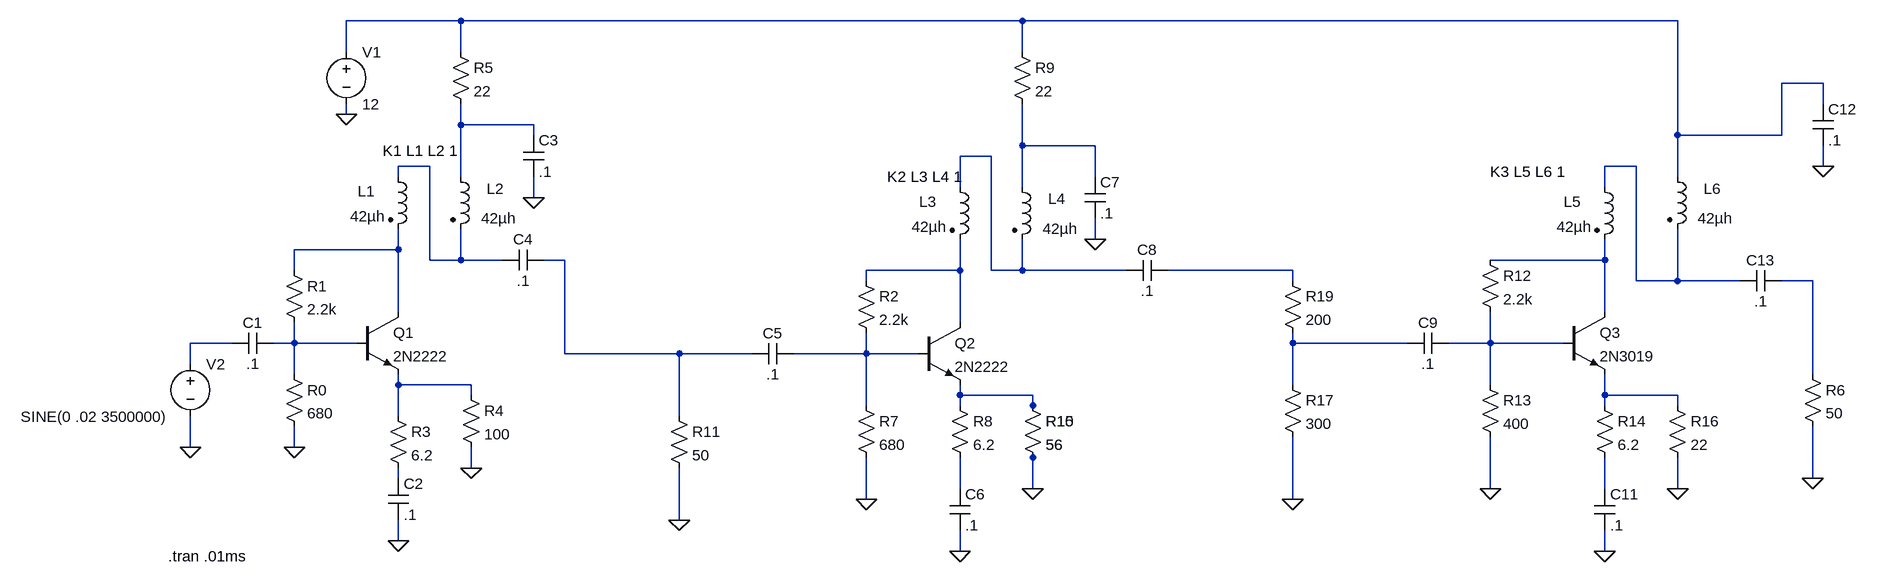
[diagram p0: schematic farhan3.asc]
farhan3.asc, the LTspice schematic file:
Version 4
SHEET 1 2164 768
WIRE -576 256 -576 224
WIRE -576 384 -576 336
WIRE -512 224 -576 224
WIRE -416 112 -416 80
WIRE -416 224 -448 224
WIRE -416 224 -416 192
WIRE -416 272 -416 224
WIRE -416 384 -416 352
WIRE -336 -224 -336 -272
WIRE -336 -128 -336 -144
WIRE -320 224 -416 224
WIRE -256 -32 -256 -48
WIRE -256 80 -416 80
WIRE -256 80 -256 48
WIRE -256 176 -256 80
WIRE -256 288 -256 272
WIRE -256 336 -256 288
WIRE -256 432 -256 416
WIRE -256 528 -256 496
WIRE -208 -48 -256 -48
WIRE -208 96 -208 -48
WIRE -160 -272 -336 -272
WIRE -160 -224 -160 -272
WIRE -160 -112 -160 -144
WIRE -160 -32 -160 -112
WIRE -160 96 -208 96
WIRE -160 96 -160 48
WIRE -144 288 -256 288
WIRE -144 304 -144 288
WIRE -144 416 -144 384
WIRE -96 96 -160 96
WIRE -48 -112 -160 -112
WIRE -48 -96 -48 -112
WIRE -48 0 -48 -32
WIRE 0 96 -32 96
WIRE 0 240 0 96
WIRE 176 240 0 240
WIRE 176 336 176 240
WIRE 176 496 176 416
WIRE 288 240 176 240
WIRE 464 128 464 112
WIRE 464 240 352 240
WIRE 464 240 464 208
WIRE 464 320 464 240
WIRE 464 464 464 400
WIRE 544 240 464 240
WIRE 608 -16 608 -64
WIRE 608 112 464 112
WIRE 608 112 608 64
WIRE 608 192 608 112
WIRE 608 304 608 288
WIRE 608 320 608 304
WIRE 608 448 608 400
WIRE 608 544 608 512
WIRE 656 -64 608 -64
WIRE 656 112 656 -64
WIRE 704 -272 -160 -272
WIRE 704 -224 704 -272
WIRE 704 -80 704 -144
WIRE 704 -16 704 -80
WIRE 704 112 656 112
WIRE 704 112 704 64
WIRE 720 304 608 304
WIRE 720 320 720 304
WIRE 720 448 720 400
WIRE 816 -80 704 -80
WIRE 816 -32 816 -80
WIRE 816 64 816 32
WIRE 864 112 704 112
WIRE 1120 112 928 112
WIRE 1120 128 1120 112
WIRE 1120 224 1120 208
WIRE 1120 288 1120 224
WIRE 1120 464 1120 368
WIRE 1296 224 1120 224
WIRE 1424 224 1360 224
WIRE 1424 224 1424 176
WIRE 1424 288 1424 224
WIRE 1424 448 1424 368
WIRE 1536 224 1424 224
WIRE 1600 -16 1600 -48
WIRE 1600 96 1424 96
WIRE 1600 96 1600 64
WIRE 1600 176 1600 96
WIRE 1600 304 1600 272
WIRE 1600 320 1600 304
WIRE 1600 448 1600 400
WIRE 1600 544 1600 512
WIRE 1648 -48 1600 -48
WIRE 1648 128 1648 -48
WIRE 1712 -272 704 -272
WIRE 1712 -96 1712 -272
WIRE 1712 -32 1712 -96
WIRE 1712 128 1648 128
WIRE 1712 128 1712 48
WIRE 1712 304 1600 304
WIRE 1712 320 1712 304
WIRE 1712 448 1712 400
WIRE 1808 128 1712 128
WIRE 1872 -96 1712 -96
WIRE 1872 -96 1872 -176
WIRE 1920 128 1872 128
WIRE 1920 272 1920 128
WIRE 1920 432 1920 352
WIRE 1936 -176 1872 -176
WIRE 1936 -144 1936 -176
WIRE 1936 -48 1936 -80
FLAG -416 384 0
FLAG -144 416 0
FLAG -256 528 0
FLAG -48 0 0
FLAG 1920 432 0
FLAG -336 -128 0
FLAG -576 384 0
FLAG 608 544 0
FLAG 464 464 0
FLAG 816 64 0
FLAG 720 448 0
FLAG 176 496 0
FLAG 1424 448 0
FLAG 1936 -48 0
FLAG 1712 448 0
FLAG 1120 464 0
FLAG 1600 544 0
SYMBOL cap -448 208 R90
WINDOW 0 0 32 VBottom 0
WINDOW 3 32 32 VTop 0
SYMATTR InstName C1
SYMATTR Value .1
SYMBOL res -432 96 R0
SYMATTR InstName R1
SYMATTR Value 2.2k
SYMBOL res -432 256 R0
SYMATTR InstName R0
SYMATTR Value 680
SYMBOL npn -320 176 R0
SYMATTR InstName Q1
SYMATTR Value 2N2222
SYMBOL res -272 320 R0
SYMATTR InstName R3
SYMATTR Value 6.2
SYMBOL res -160 288 R0
SYMATTR InstName R4
SYMATTR Value 100
SYMBOL cap -272 432 R0
SYMATTR InstName C2
SYMATTR Value .1
SYMBOL res -176 -240 R0
SYMATTR InstName R5
SYMATTR Value 22
SYMBOL cap -64 -96 R0
SYMATTR InstName C3
SYMATTR Value .1
SYMBOL ind2 -272 -48 R0
WINDOW 0 -47 38 Left 0
WINDOW 3 -58 77 Left 0
SYMATTR InstName L1
SYMATTR Value 42µh
SYMATTR Type ind
SYMBOL ind2 -176 -48 R0
WINDOW 0 56 34 Left 0
WINDOW 3 47 80 Left 0
SYMATTR InstName L2
SYMATTR Value 42µh
SYMATTR Type ind
SYMBOL cap -32 80 R90
WINDOW 0 0 32 VBottom 0
WINDOW 3 32 32 VTop 0
SYMATTR InstName C4
SYMATTR Value .1
SYMBOL res 1904 256 R0
SYMATTR InstName R6
SYMATTR Value 50
SYMBOL voltage -336 -240 R0
WINDOW 123 0 0 Left 0
WINDOW 39 0 0 Left 0
SYMATTR InstName V1
SYMATTR Value 12
SYMBOL voltage -576 240 R0
WINDOW 3 -261 97 Left 0
WINDOW 123 0 0 Left 0
WINDOW 39 -259 132 Left 0
SYMATTR InstName V2
SYMATTR Value SINE(0 .02 3500000)
SYMBOL npn 544 192 R0
SYMATTR InstName Q2
SYMATTR Value 2N2222
SYMBOL cap 352 224 R90
WINDOW 0 0 32 VBottom 0
WINDOW 3 32 32 VTop 0
SYMATTR InstName C5
SYMATTR Value .1
SYMBOL res 448 112 R0
SYMATTR InstName R2
SYMATTR Value 2.2k
SYMBOL res 448 304 R0
SYMATTR InstName R7
SYMATTR Value 680
SYMBOL res 592 304 R0
SYMATTR InstName R8
SYMATTR Value 6.2
SYMBOL cap 592 448 R0
SYMATTR InstName C6
SYMATTR Value .1
SYMBOL ind2 592 -32 R0
WINDOW 0 -47 38 Left 0
WINDOW 3 -58 77 Left 0
SYMATTR InstName L3
SYMATTR Value 42µh
SYMATTR Type ind
SYMBOL ind2 688 -32 R0
WINDOW 0 56 34 Left 0
WINDOW 3 47 80 Left 0
SYMATTR InstName L4
SYMATTR Value 42µh
SYMATTR Type ind
SYMBOL res 688 -240 R0
SYMATTR InstName R9
SYMATTR Value 22
SYMBOL cap 800 -32 R0
SYMATTR InstName C7
SYMATTR Value .1
SYMBOL cap 928 96 R90
WINDOW 0 0 32 VBottom 0
WINDOW 3 32 32 VTop 0
SYMATTR InstName C8
SYMATTR Value .1
SYMBOL res 704 304 R0
SYMATTR InstName R10
SYMATTR Value 56
SYMBOL res 160 320 R0
SYMATTR InstName R11
SYMATTR Value 50
SYMBOL cap 1360 208 R90
WINDOW 0 0 32 VBottom 0
WINDOW 3 32 32 VTop 0
SYMATTR InstName C9
SYMATTR Value .1
SYMBOL res 1408 80 R0
SYMATTR InstName R12
SYMATTR Value 2.2k
SYMBOL res 1408 272 R0
SYMATTR InstName R13
SYMATTR Value 400
SYMBOL npn 1536 176 R0
SYMATTR InstName Q3
SYMATTR Value 2N3019
SYMBOL res 1584 304 R0
SYMATTR InstName R14
SYMATTR Value 6.2
SYMBOL res 704 304 R0
SYMATTR InstName R15
SYMATTR Value 56
SYMBOL res 1696 304 R0
SYMATTR InstName R16
SYMATTR Value 22
SYMBOL cap 1584 448 R0
SYMATTR InstName C11
SYMATTR Value .1
SYMBOL ind2 1584 -32 R0
WINDOW 0 -47 38 Left 0
WINDOW 3 -58 77 Left 0
SYMATTR InstName L5
SYMATTR Value 42µh
SYMATTR Type ind
SYMBOL ind2 1696 -48 R0
WINDOW 0 56 34 Left 0
WINDOW 3 47 80 Left 0
SYMATTR InstName L6
SYMATTR Value 42µh
SYMATTR Type ind
SYMBOL cap 1920 -144 R0
SYMATTR InstName C12
SYMATTR Value .1
SYMBOL res 1104 272 R0
SYMATTR InstName R17
SYMATTR Value 300
SYMBOL cap 1872 112 R90
WINDOW 0 0 32 VBottom 0
WINDOW 3 32 32 VTop 0
SYMATTR InstName C13
SYMATTR Value .1
SYMBOL res 1104 112 R0
SYMATTR InstName R19
SYMATTR Value 200
TEXT -280 -72 Left 0 !K1 L1 L2 1
TEXT -610 552 Left 0 !.tran .01ms
TEXT 496 -32 Left 0 !K2 L3 L4 1
TEXT 1424 -40 Left 0 !K3 L5 L6 1

The netlist it stands for:
* farhan3.asc
C1 N003 N001 .1
R1 N002 N003 2.2k
R0 N003 0 680
Q1 N002 N003 N006 0 2N2222
R3 N006 N007 6.2
R4 N006 0 100
C2 N007 0 .1
R5 N004 N008 22
C3 N008 0 .1
L1 N005 N002 42µh
L2 N008 N005 42µh
C4 N009 N005 .1
R6 N023 0 50
V1 N004 0 12
V2 N001 0 SINE(0 .02 3500000)
Q2 N010 N011 N013 0 2N2222
C5 N011 N009 .1
R2 N010 N011 2.2k
R7 N011 0 680
R8 N013 N014 6.2
C6 N014 0 .1
L3 N012 N010 42µh
L4 N015 N012 42µh
R9 N004 N015 22
C7 N015 0 .1
C8 N016 N012 .1
R10 N013 0 56
R11 N009 0 50
C9 N018 N017 .1
R12 N020 N018 2.2k
R13 N018 0 400
Q3 N020 N018 N021 0 2N3019
R14 N021 N022 6.2
R15 N013 0 56
R16 N021 0 22
C11 N022 0 .1
L5 N019 N020 42µh
L6 N004 N019 42µh
C12 N004 0 .1
R17 N017 0 300
C13 N023 N019 .1
R19 N016 N017 200
.model NPN NPN
.model PNP PNP
.lib standard.bjt
K1 L1 L2 1
.tran .01ms
K2 L3 L4 1
K3 L5 L6 1
.backanno
.end